# EAGLE design wb_SMD (EAGLE 6.1)
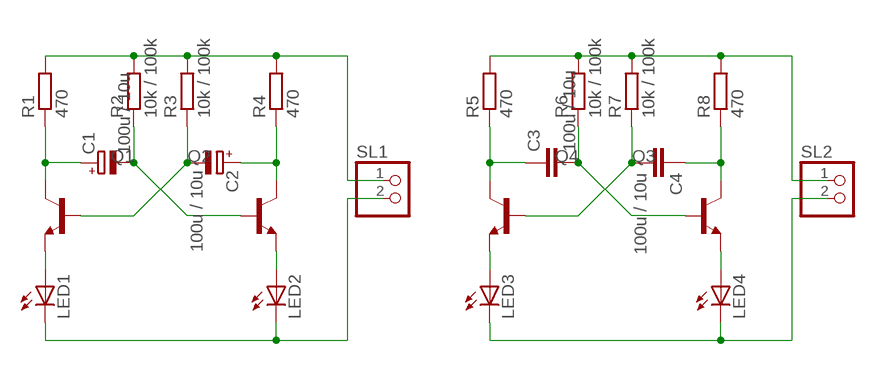
[diagram p0: schematic, sheet 1]

## Parts
C1  100u / 10u  CPOL-EUB  [PANASONIC_B]
C2  100u / 10u  CPOL-EUB  [PANASONIC_B]
C3  100u / 10u  C-EUC0805K  [C0805K]
C4  100u / 10u  C-EUC0805K  [C0805K]
LED1  LEDSML0805  [SML0805]
LED2  LEDSML0805  [SML0805]
LED3  LEDSML0805  [SML0805]
LED4  LEDSML0805  [SML0805]
Q1  BC817-25-NPN-SOT23-BEC  [SOT23-BEC]
Q2  BC817-25-NPN-SOT23-BEC  [SOT23-BEC]
Q3  BC817-25-NPN-SOT23-BEC  [SOT23-BEC]
Q4  BC817-25-NPN-SOT23-BEC  [SOT23-BEC]
R1  470  R-EU_M1206  [M1206]
R2  10k / 100k  R-EU_M1206  [M1206]
R3  10k / 100k  R-EU_M1206  [M1206]
R4  470  R-EU_M1206  [M1206]
R5  470  R-EU_M1206  [M1206]
R6  10k / 100k  R-EU_M1206  [M1206]
R7  10k / 100k  R-EU_M1206  [M1206]
R8  470  R-EU_M1206  [M1206]
SL1  PINHD-1X2  [1X02]
SL2  PINHD-1X2  [1X02]

## Nets
GND: LED1.C LED2.C SL1.2
GND1: LED3.C LED4.C SL2.2
N$1: C2.- Q1.B R3.1
N$2: C1.- Q2.B R2.1
N$3: C1.+ Q1.C R1.1
N$4: C2.+ Q2.C R4.1
N$5: LED1.A Q1.E
N$6: LED2.A Q2.E
N$7: C4.2 Q4.B R7.1
N$8: C3.2 Q3.B R6.1
N$9: C3.1 Q4.C R5.1
N$10: C4.1 Q3.C R8.1
N$11: LED3.A Q4.E
N$12: LED4.A Q3.E
VCC: R1.2 R2.2 R3.2 R4.2 SL1.1
VCC1: R5.2 R6.2 R7.2 R8.2 SL2.1

## Library data of the parts
C1 C2 = rcl:CPOL-EU: POLARIZED CAPACITOR, European symbol
C3 C4 = rcl:C-EU: CAPACITOR, European symbol
LED1-LED4 = led:LED: LED OSRAM: - CHIPLED LG R971, LG N971, LY N971, LG Q971, LY Q971, LO R971, LY R971 LH N974, LH R974 LS Q976, LO Q976, LY Q976 LO Q996 - Hyper CHIPLED LW Q18S LB Q993, LB Q99A, LB R99A - SideLED LS A670, LO A670, LY A670, LG A670, LP A670 LB A673, LV A673, LT A673, LW A673 LH A674 LY A675 LS A676, LA A676, LO A676, LY A676, LW A676 LS A679, LY A679, LG A679 - Hyper Micro SIDELED® LS Y876, LA Y876, LO Y876, LY Y876 LT Y87S - SmartLED LW L88C, LW L88S LB L89C, LB L89S, LG L890 LS L89K, LO L89K, LY L89K LS L896, LA L896, LO L896, LY L896 - TOPLED LS T670, LO T670, LY T670, LG T670, LP T670 LSG T670, LSP T670, LSY T670, LOP T670, LYG T670 LG T671, LOG T671, LSG T671 LB T673, LV T673, LT T673, LW T673 LH T674 LS T676, LA T676, LO T676, LY T676, LB T676, LH T676, LSB T676, LW T676 LB T67C, LV T67C, LT T67C, LS T67K, LO T67K, LY T67K, LW E67C LS E67B, LA E67B, LO E67B, LY E67B, LB E67C, LV E67C, LT E67C LW T67C LS T679, LY T679, LG T679 LS T770, LO T770, LY T770, LG T770, LP T770 LB T773, LV T773, LT T773, LW T773 LH T774 LS E675, LA E675, LY E675, LS T675 LS T776, LA T776, LO T776, LY T776, LB T776 LHGB T686 LT T68C, LB T68C - Hyper Mini TOPLED® LB M676 - Mini TOPLED Santana® LG M470 LS M47K, LO M47K, LY M47K Source: http://www.osram.convergy.de LUXEON: - LUMILED® LXK2-PW12-R00, LXK2-PW12-S00, LXK2-PW14-U00, LXK2-PW14-V00 LXK2-PM12-R00, LXK2-PM12-S00, LXK2-PM14-U00 LXK2-PE12-Q00, LXK2-PE12-R00, LXK2-PE12-S00, LXK2-PE14-T00, LXK2-PE14-U00 LXK2-PB12-K00, LXK2-PB12-L00, LXK2-PB12-M00, LXK2-PB14-N00, LXK2-PB14-P00, LXK2-PB14-Q00 LXK2-PR12-L00, LXK2-PR12-M00, LXK2-PR14-Q00, LXK2-PR14-R00 LXK2-PD12-Q00, LXK2-PD12-R00, LXK2-PD12-S00 LXK2-PH12-R00, LXK2-PH12-S00 LXK2-PL12-P00, LXK2-PL12-Q00, LXK2-PL12-R00 Source: www.luxeon.com KINGBRIGHT: KA-3528ASYC Source: www.kingbright.com
Q1-Q4 = transistor:*-NPN-: NPN Transistror BF959 corrected 2008.03.06
R1-R8 = rcl:R-EU_: RESISTOR, European symbol
SL1 SL2 = pinhead:PINHD-1X2: PIN HEADER

## Board
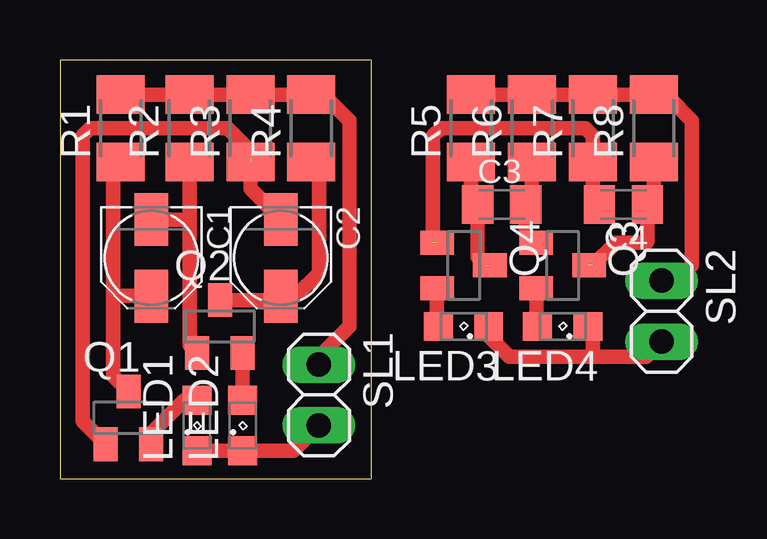
[diagram p1: board, top side]

Size 13 x 17.45 mm. Coordinates in mm from the lower left corner, seen from the top.
Outline: 0,0 13,0 13,17.45 0,17.45 0,0
Copper layers (1*16): Top 0.035mm / dielectric 1.5mm / Bottom 0.035mm
Design rules: minimum track width 10mil, minimum drill 24mil, track to track 8mil, track to pad 8mil, pad to pad 8mil, via to via 8mil, smd to smd 8mil, copper to edge 40mil, drill to drill 8mil, minimum pad ring 10mil, minimum via ring 8mil, stop-mask expansion 4mil, vias tented up to drill 0mil, thermal gap 10mil

### Footprints (pad centres in the part's own frame; a part is rotated, then mirrored left to right if it is on the bottom)
PANASONIC_B = smd 2.2 x 1.4: + 1.6,0; - -1.6,0
C0805K = smd 1.3 x 1.6: 1 -1,0; 2 1,0
SML0805 = smd 1.2 x 1.2: A 1.05,0; C -1.05,0
SOT23-BEC = smd 1 x 1.4: B -0.95,-1.1; C 0,1.1; E 0.95,-1.1
M1206 = smd 1.6 x 2: 1 -1.4,0; 2 1.4,0
1X02 = drill 1.016 long: 1 -1.27,0; 2 1.27,0

### Placement (x,y rotation side)
C1  3.81,9.21 270 top
C2  9.21,9.21 270 top
C3  18.41,11.43 0 top  (outside the outline)
C4  23.5,11.43 180 top  (outside the outline)
LED1  5.71,2.22 90 top
LED2  7.62,2.22 90 top
LED3  16.83,6.35 180 top
LED4  20.95,6.35 180 top  (outside the outline)
Q1  2.86,2.54 0 top
Q2  6.67,6.35 0 top
Q3  20.95,8.89 270 top  (outside the outline)
Q4  16.83,8.89 270 top
R1  2.54,14.61 90 top
R2  5.4,14.61 90 top
R3  7.94,14.61 90 top
R4  10.48,14.61 90 top
R5  17.14,14.61 90 top  (outside the outline)
R6  19.68,14.61 90 top  (outside the outline)
R7  22.23,14.61 90 top  (outside the outline)
R8  24.77,14.61 90 top  (outside the outline)
SL1  10.79,3.49 270 top
SL2  25.08,6.99 270 top  (outside the outline)

### Tracks (layer width: path | path; a pad name or v marks a point on that pad's centre or on a via)
GND
  Top 0.61: LED1.C LED2.C 9.74,1.17 SL1.2
GND1
  Top 0.61: LED3.C 17.88,5.93 18.73,5.08 22.23,5.08 | 22.23,5.08 24.45,5.08 SL2.2 | LED4.C 22.23,6.03 22.23,5.08
N$1  (1 unrouted)
  Top 0.61: R3.1 7.94,12.08 C2.- | 7.94,13.34 7.94,13.65 6.99,14.61 1.27,14.61 0.95,14.29 0.95,2.4 Q1.B
N$2
  Top 0.61: 3.82,10.81 C1.- 3.82,10.79 5.4,10.79 | 5.4,5.57 Q2.B 5.4,5.57 5.4,10.79 | R2.1 5.4,10.79
N$3
  Top 0.61: R1.1 2.22,13.21 2.22,7.62 | 3.49,7.3 3.5,7.3 C1.+ 3.8,7.62 2.22,7.62 | Q1.C 2.22,4.28 2.22,7.62
N$4
  Top 0.61: R4.1 10.66,13.21 10.79,13.34 10.79,8.57 9.84,7.62 C2.+ | C2.+ | Q2.C 9.05,7.45 C2.+
N$5
  Top 0.61: LED1.A 5.18,3.27 3.81,1.91 Q1.E
N$6
  Top 0.61: Q2.E LED2.A
N$7  (1 unrouted)
  Top 0.61: 15.56,9.84 15.56,14.29 15.88,14.61 21.91,14.61 22.23,14.29 R7.1 22.23,11.7 C4.2
N$8
  Top 0.61: 20.05,13.21 R6.1 19.68,11.7 C3.2 19.41,10.28 Q3.B
N$9  (1 unrouted)
  Top 0.61: R5.1 17.14,11.7 C3.1 17.41,9.26 17.78,8.89
N$10  (1 unrouted)
  Top 0.61: R8.1 24.77,11.7 C4.1 24.5,9.89 24.45,9.84 23.18,9.84 22.23,8.89
N$11
  Top 0.61: Q4.E 15.73,6.08 LED3.A
N$12
  Top 0.61: Q3.E 19.86,6.08 LED4.A
VCC
  Top 0.406: R4.2 10.48,15.88 10.79,15.88 10.79,16.19
  Top 0.61: R1.2 R2.2 R3.2 R4.2 | 10.79,15.88 11.11,15.88 12.06,14.92 12.06,6.35 10.79,5.08 SL1.1
VCC1
  Top 0.61: R8.2 R7.2 R6.2 R5.2 25.4,16 | 25.4,16 25.4,16.19 | 25.4,16 25.4,15.88 26.35,14.92 26.35,8.89 25.72,8.26 SL2.1